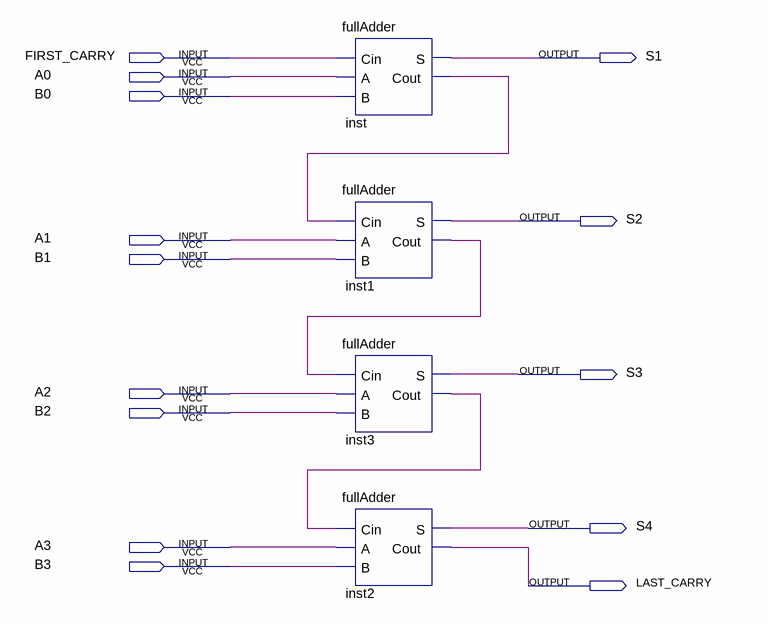
[diagram p0: schematic sheet]
// Quartus schematic adderFourBits.bdf as structural Verilog: 4 symbols, 14 pins
module adderFourBits (
  input  FIRST_CARRY,
  input  A0,
  input  B0,
  input  A1,
  input  B1,
  input  A2,
  input  B2,
  input  A3,
  input  B3,
  output S1,
  output S2,
  output S3,
  output S4,
  output LAST_CARRY
);

  wire inst1_cout, inst3_cout, inst_cout;

  fullAdder inst (.Cin(FIRST_CARRY), .A(A0), .B(B0), .S(S1), .Cout(inst_cout));
  fullAdder inst1 (.Cin(inst_cout), .A(A1), .B(B1), .S(S2), .Cout(inst1_cout));
  fullAdder inst3 (.Cin(inst1_cout), .A(A2), .B(B2), .S(S3), .Cout(inst3_cout));
  fullAdder inst2 (.Cin(inst3_cout), .A(A3), .B(B3), .S(S4), .Cout(LAST_CARRY));
endmodule
